# Altium schematic sheet DAC.SchDoc
size A4; SheetNumber: 5; SheetTotal: 6
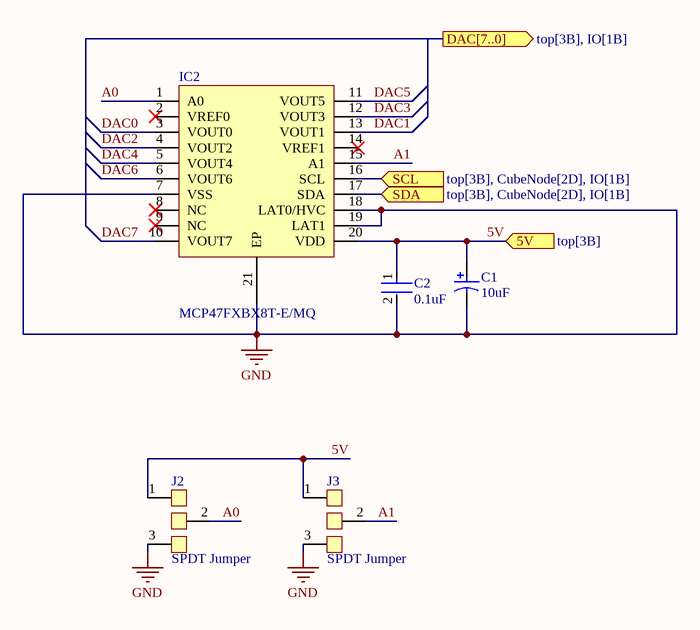
[diagram p0: DAC.SchDoc]

## Parts
C1  10uF  [KEMT-A-3216-18-2_M]
C2  0.1uF  [FP-GRM033-0_03-MFG]
IC2  MCP47FXBX8T-E/MQ  [MCP47FXBX8T-E/MQ]
J2  SPDT Jumper  [SPDT Jumper]
J3  SPDT Jumper  [SPDT Jumper]

## Ports
5V (in, see top[3B]), DAC[7..0] (out, see top[3B], IO[1B]), SCL (in, see top[3B], CubeNode[2D], IO[1B]), SDA (in, see top[3B], CubeNode[2D], IO[1B])

## Nets
GND: C1.2 C2.2 IC2.7(VSS) IC2.18(LAT0/HVC) IC2.19(LAT1) IC2.21(EP) J2.3 J3.3
5V: C1.1 C2.1 IC2.20(VDD) J2.1 J3.1 ; port 5V
A0: IC2.1(A0) J2.2
A1: IC2.15(A1) J3.2
DAC0: IC2.3(VOUT0)
DAC1: IC2.13(VOUT1)
DAC2: IC2.4(VOUT2)
DAC3: IC2.12(VOUT3)
DAC4: IC2.5(VOUT4)
DAC5: IC2.11(VOUT5)
DAC6: IC2.6(VOUT6)
DAC7: IC2.10(VOUT7)
SCL: IC2.16(SCL) ; port SCL
SDA: IC2.17(SDA) ; port SDA

Not connected (* = marked no-connect by the designer): IC2 2(VREF0)* 8(NC)* 9(NC)* 14(VREF1)*

## Library data of the parts
C1 = CMP-2000-05172-1: Capacitor, Tantalum, 10 uF, +/- 10%, 10 V, -55 to 125 degC, 2-Pin SMD (1206), RoHS, Tape and Reel; Manufacturer Size Code: A; Manufacturer: Kemet; Type: Molded; Online Catalog: T491Series; Other Names: 399-3684-2; Voltage - Rated: 10V; Lifetime @ Temp.: 2000Hrs@85degC; Product Training Modules: CapacitorBasics-TypicalUsesforCapacitorsDeratingGuidelinesforSurfaceMountTantalumCapacitors; ESR (Equivalent Series Resistance): 3.8Ohm; Capacitance: 10µF; Catalog Drawings: T49x,T5xxSeries_A-side1T49x,T5xxSeries_A,B-side2T49x,T5xxSeries_A,SBottom; Family: TantalumCapacitors; Manufacturer URL: http://www.kemet.com/; Datasheet URL: http://www.farnell.com/datasheets/1824869.pdf; Package Reference: 1206; Packaging: Tape&Reel(TR); Series: T491; Operating Temperature: -55degC~125degC; Mounting Type: SurfaceMount; Height - Seated (Max): 0.071"(1.80mm); Package / Case: 1206(3216Metric); Package Description: 2-Pin Surface Mount Device, Body 3.2 x 1.6 mm; Features: GeneralPurpose; Tolerance: ±10%; Lead Spacing: -; Size / Dimension: 0.126"Lx0.063"W(3.20mmx1.60mm); Standard Package: 2,000; Datasheet Version: Apr-14; Category: Capacitors
C2 = CMP-06035-000062-2: Chip Multilayer Ceramic Capacitors for General Purpose, 0201, 0.10uF, X5R, 15%, 10%, 6.3V; Capacitance: 100nF; Min Operating Temperature: -55°C; Lead Free: Lead Free; Radiation Hardening: No; Dielectric: X5R; Voltage Rating (DC): 6.3V; REACH SVHC: No SVHC; Case/Package: 0201; Voltage Rating: 6.3V; Length: 0.6mm; Max Operating Temperature: 85°C; Width: 0.012inch; Depth: 0.3mm; Material: Ceramic; Case Code (Metric): 0603; Thickness: 0.013inch; Packaging: Tape and Reel; Height: 0.3mm; Weight: 6E-06oz; Package Quantity: 1; Mount: Surface Mount; Voltage: 6.3V; Case Code (Imperial): 0201; Tolerance: 10%; Termination: SMD/SMT